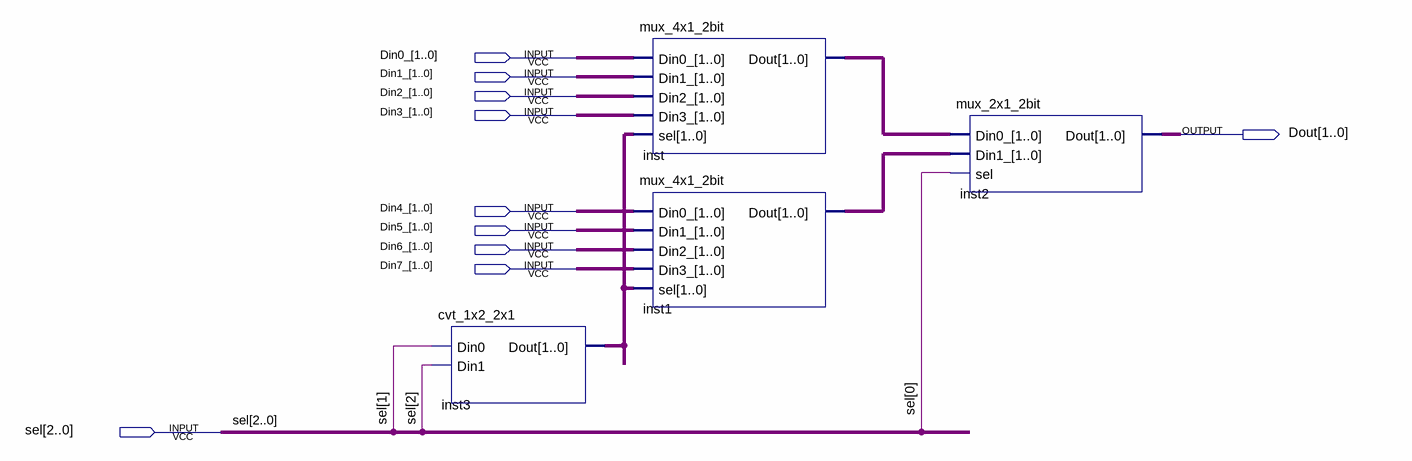
[diagram p0: schematic sheet]
// Quartus schematic mux_8x1_2bit.bdf as structural Verilog: 4 symbols, 10 pins
module mux_8x1_2bit (
  input  [1:0] Din0_,
  input  [1:0] Din1_,
  input  [1:0] Din2_,
  input  [1:0] Din3_,
  input  [1:0] Din4_,
  input  [1:0] Din5_,
  input  [1:0] Din6_,
  input  [1:0] Din7_,
  input  [2:0] sel,
  output [1:0] Dout
);

  wire [1:0] inst1_dout, inst3_dout, inst_dout;

  cvt_1x2_2x1 inst3 (.Din0(sel[1]), .Din1(sel[2]), .Dout(inst3_dout));
  mux_4x1_2bit inst (.Din0_(Din0_), .Din1_(Din1_), .Din2_(Din2_), .Din3_(Din3_), .sel(inst3_dout), .Dout(inst_dout));
  mux_4x1_2bit inst1 (.Din0_(Din4_), .Din1_(Din5_), .Din2_(Din6_), .Din3_(Din7_), .sel(inst3_dout), .Dout(inst1_dout));
  mux_2x1_2bit inst2 (.Din0_(inst_dout), .Din1_(inst1_dout), .sel(sel[0]), .Dout(Dout));
endmodule
